# EAGLE schematic LoRaMicrobit1.0 (EAGLE 7.6.0)
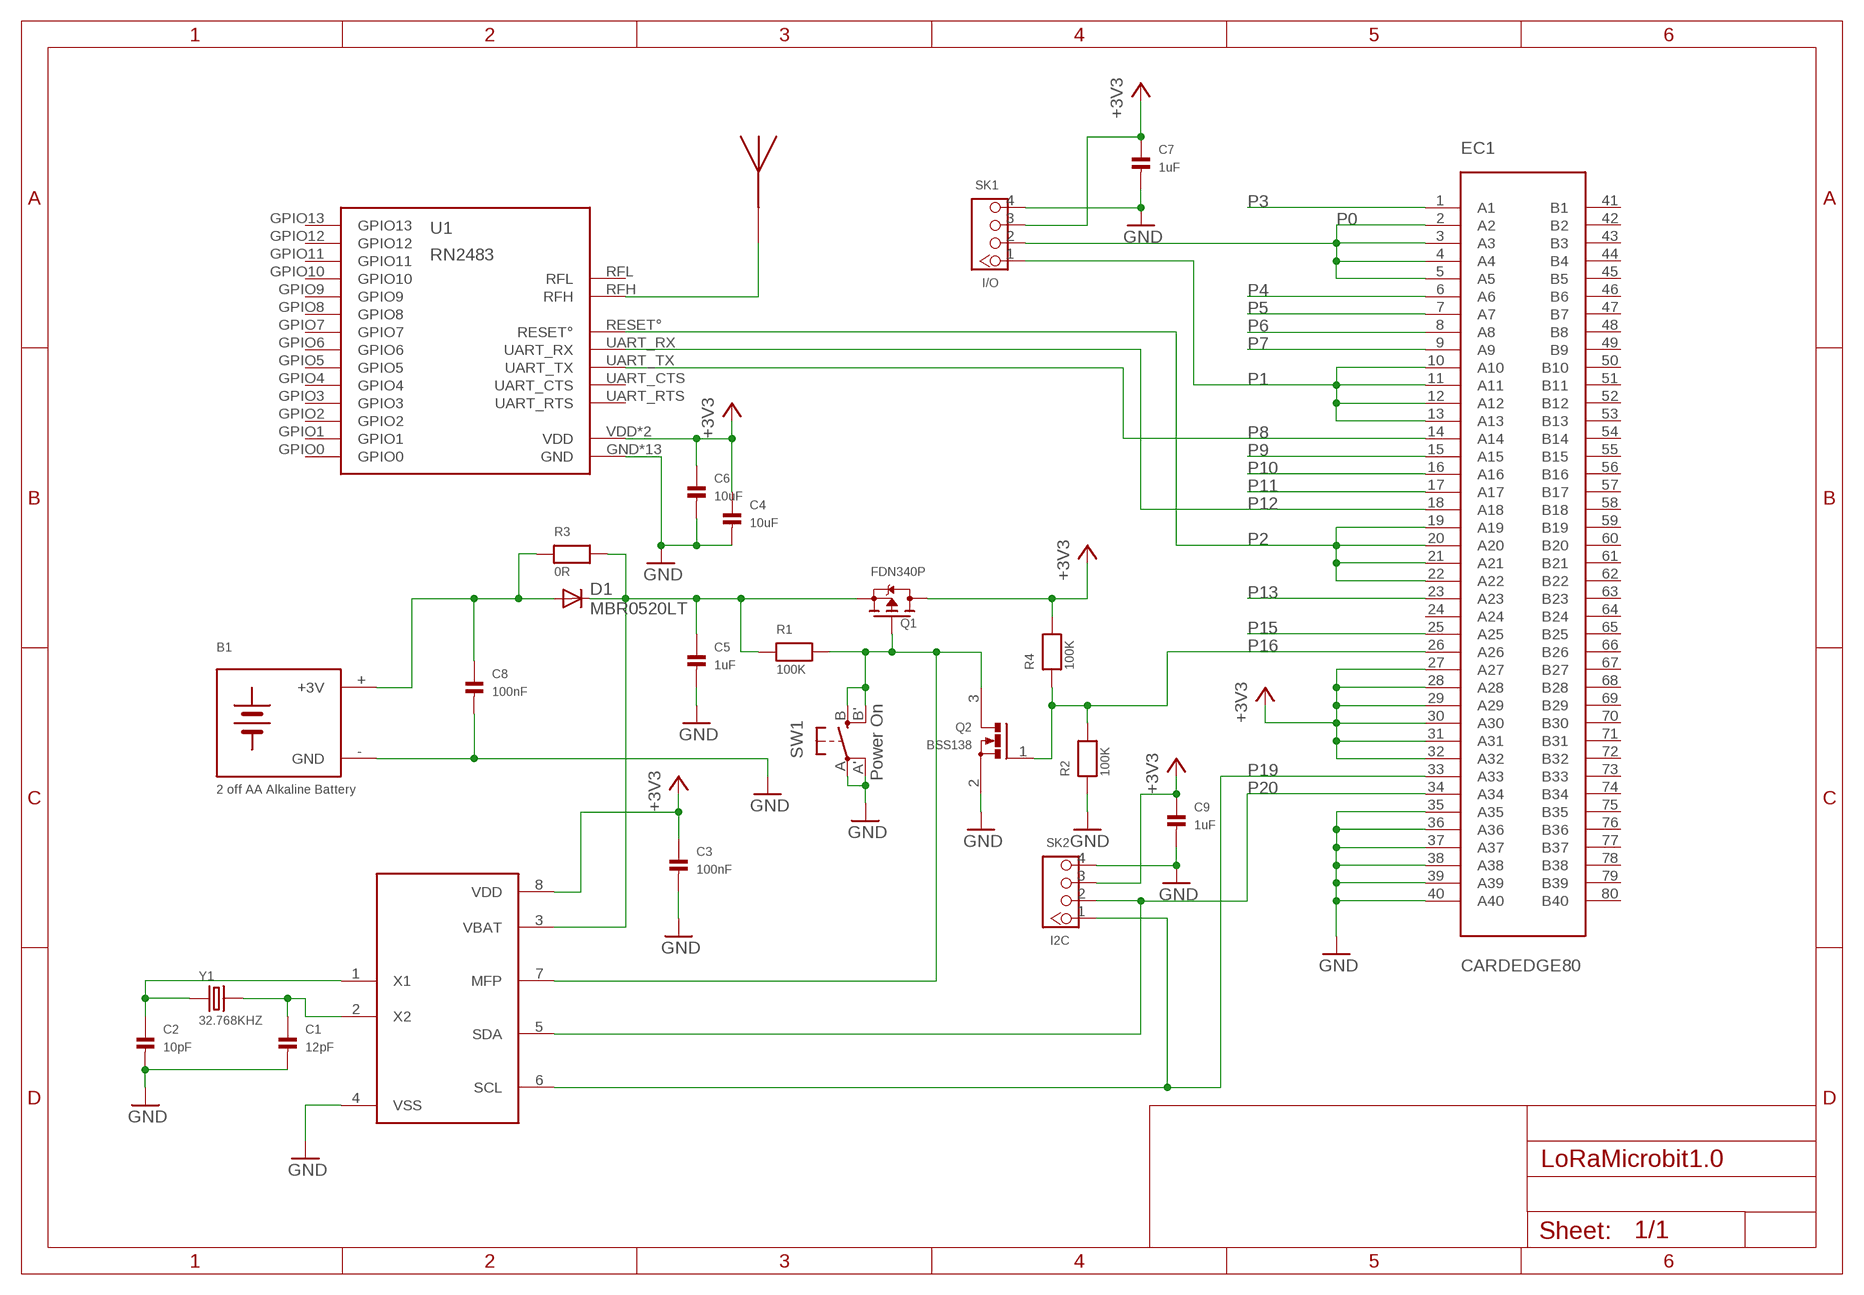
[diagram p0: schematic, sheet 1]

## Parts
B1  2 off AA Alkaline Battery  2AABATTERY  [2AABATTERY]
C1  12pF  CAP_CERAMIC0603  [0603]
C2  10pF  CAP_CERAMIC0603  [0603]
C3  100nF  CAP_CERAMIC0603  [0603]
C4  10uF  CAP_CERAMIC0603  [0603]
C5  1uF  CAP_CERAMIC0603  [0603]
C6  10uF  CAP_CERAMIC0603  [0603]
C7  1uF  CAP_CERAMIC0603  [0603]
C8  100nF  CAP_CERAMIC0603  [0603]
C9  1uF  CAP_CERAMIC0603  [0603]
D1  MBR0520LT  [SOD123]
EC1  CARDEDGE80  [CARDEDGE80]
Q1  FDN340P  MOSFET-P  [SOT23-R]
Q2  BSS138  MOSFET-NREFLOW  [SOT23-R]
R1  100K  RESISTOR0603  [0603]
R2  100K  RESISTOR0603  [0603]
R3  0R  RESISTOR0603  [0603]
R4  100K  RESISTOR0603  [0603]
SK1  I/O  GROVE-CONNECTOR-DIP-90D(4P-2.0)  [HW4-2.0-90D]
SK2  I2C  GROVE-CONNECTOR-DIP-90D(4P-2.0)  [HW4-2.0-90D]
SW1  Power On  SPST_TACT-EVQQ2  [EVQ-Q2]
U1  RN2483  [RN2483]
U2  MCP7940N  [SOIC8-N_MC]
U$2  0868AT43A0020  [0868AT043A0020]
Y1  32.768KHZ  SMD-CRYSTAL-ABS07-32.768KHZ-7PF-20PPM-70K(2P-3.2X1.5MM)  [X2-SMD-3.2X1.5X0.55MM]

## Nets
+3V3: C3.1 C4.1 C6.1 C7.1 C9.1 EC1.27(A27) EC1.28(A28) EC1.29(A29) EC1.30(A30) EC1.31(A31) EC1.32(A32) Q1.3(D) R4.2 SK1.3 SK2.3 U1.VDD U1.VDD2(VDD) U2.8(VDD)
GND: B1.-(GND) C1.2 C2.2 C3.2 C4.2 C5.2 C6.2 C7.2 C8.2 C9.2 EC1.35(A35) EC1.36(A36) EC1.37(A37) EC1.38(A38) EC1.39(A39) EC1.40(A40) Q2.2(S) R2.1 SK1.4 SK2.4 SW1.A'(P1) SW1.A(P) U1.GND U1.GND1(GND) U1.GND2(GND) U1.GND3(GND) U1.GND4(GND) U1.GND5(GND) U1.GND6(GND) U1.GND7(GND) U1.GND8(GND) U1.GND9(GND) U1.GND10(GND) U1.GND11(GND) U1.GND12(GND) U2.4(VSS)
N$1: U1.RFH U$2.P$1
N$2: C2.1 U2.1(X1) Y1.1
N$3: C1.1 U2.2(X2) Y1.2
N$5: B1.+(+3V) C8.1 D1.A R3.1
N$8: C5.1 D1.C Q1.2(S) R1.1 R3.2 U2.3(VBAT)
N$9: Q1.1(G) Q2.3(D) R1.2 SW1.B'(S1) SW1.B(S) U2.7(MFP)
P0: EC1.2(A2) EC1.3(A3) EC1.4(A4) EC1.5(A5) SK1.2
P1: EC1.10(A10) EC1.11(A11) EC1.12(A12) EC1.13(A13) SK1.1
P2: EC1.19(A19) EC1.20(A20) EC1.21(A21) EC1.22(A22) U1.RESET°
P3: EC1.1(A1)
P4: EC1.6(A6)
P5: EC1.7(A7)
P6: EC1.8(A8)
P7: EC1.9(A9)
P8: EC1.14(A14) U1.UART_TX
P9: EC1.15(A15)
P10: EC1.16(A16)
P11: EC1.17(A17)
P12: EC1.18(A18) U1.UART_RX
P13: EC1.23(A23)
P15: EC1.25(A25)
P16: EC1.26(A26) Q2.1(G) R2.2 R4.1
P19: EC1.33(A33) SK2.1 U2.6(SCL)
P20: EC1.34(A34) SK2.2 U2.5(SDA)
Unconnected: EC1.24(A24) EC1.41(B1) EC1.42(B2) EC1.43(B3) EC1.44(B4) EC1.45(B5) EC1.46(B6) EC1.47(B7) EC1.48(B8) EC1.49(B9) EC1.50(B10) EC1.51(B11) EC1.52(B12) EC1.53(B13) EC1.54(B14) EC1.55(B15) EC1.56(B16) EC1.57(B17) EC1.58(B18) EC1.59(B19) EC1.60(B20) EC1.61(B21) EC1.62(B22) EC1.63(B23) EC1.64(B24) EC1.65(B25) EC1.66(B26) EC1.67(B27) EC1.68(B28) EC1.69(B29) EC1.70(B30) EC1.71(B31) EC1.72(B32) EC1.73(B33) EC1.74(B34) EC1.75(B35) EC1.76(B36) EC1.77(B37) EC1.78(B38) EC1.79(B39) EC1.80(B40) U1.GPIO0 U1.GPIO1 U1.GPIO2 U1.GPIO3 U1.GPIO4 U1.GPIO5 U1.GPIO6 U1.GPIO7 U1.GPIO8 U1.GPIO9 U1.GPIO10 U1.GPIO11 U1.GPIO12 U1.GPIO13 U1.RFL U1.UART_CTS U1.UART_RTS

## Library data of the parts
B1 = Microbit:2AABATTERY
C1-C9 = microbuilder:CAP_CERAMIC: Ceramic Capacitors 0402 - 0402 Surface Mount Capacitors 0.1uF 10V 10% [Digikey: 490-1318-2-ND] 0603 - 0603 Surface Mount Capacitors 16 pF 50V 5% [Digikey: 445-5051-2-ND] 22 pF 50V [Digikey: PCC220ACVTR-ND] 33 pF 50V 5% [Digikey: 490-1415-1-ND] 56pF 50V 5% [Digikey: 490-1421-1-ND] 220pF 50V 5% [Digikey: 445-1285-1-ND] 680 pF 50V 2200 pF 50V 5% C0G [Digikey: 445-1297-1-ND] 5600 pF 100V 5% X7R [Digikey: 478-3711-1-ND] 0.1 µF 25V 10% [Digikey: PCC2277TR-ND] 0.22 µF 16V 10% X7R [Digikey: 445-1318-1-ND] 1.0 µF 25V 10% [Digikey: 445-5146-2-ND] 0603 - RF Specific 3pF 250V +/-0.1pF RF [Digikey: 712-1347-1-ND] 18 pF 250V 5% [Digikey: 478-3505-1-ND or 712-1322-1-ND] 56 pF 250V 5% C0G RF [Digikey: 490-4867-1-ND] 68 pF 250V RF [Digikey: 490-4868-1-ND] 0805 - 0805 Surface Mount Capacitors 220 pF 250V 2% RF Ceramic Capacitor [Digikey: 712-1398-1-ND] 1000 pF 50V 2% NP0 Ceramic Capacitor [Digikey: 478-3760-1-ND] 0.1 µF 25V 10% Ceramic Capacitor [Digikey: PCC1828TR-ND] 1.0 µF 16V 10% Ceramic Capacitor[Digikey: 490-1691-2-ND] 10.0 µF 10V 10% Ceramic Capacitor[Digikey: 709-1228-1-ND] 1206 - 1206 Surface Mount Capacitors
D1 = diode:MBR0520LT: SCHOTTKY BARRIER RECTIFIER Source: http://onsemi.com .. MBR0520LT1-D.pdf
EC1 = Microbit:CARDEDGE80: BBC Micro:Bit 80 Pos .05" Connector
Q1 = microbuilder:MOSFET-P: P-Channel Mosfet SOT-23 NTR0202PL 20V 400mA - Digikey: NTR0202PLT1GOSTR-ND NTR4101PT1G 20V 1.8A - Digikey: NTR4101PT1GOSCT-ND
Q2 = microbuilder:MOSFET-N: N-Channel Mosfet Digikey: 2N7002ET1GOSTR-ND
R1-R4 = microbuilder:RESISTOR: Resistors 0402 - 0402 Surface Mount Package 10.0K 1% 1/16W [Digikey: 311-10.0KLRTR-ND] 0603 - 0603 Surface Mount Package 0 Ohm 1/10 Watt 1% Resistor 15 Ohm 1/10 Watt 1% Resistor 33 Ohm 1/10 Watt 1% Resistor 49.9 Ohm 1/10 Watt 1% Resistor 100 Ohm 1/10 Watt 1% Resistor 150 Ohm 1/10 Watt 1% Resistor 240 Ohm 1/10 Watt 1% Resistor 390 Ohm 1/10 Watt 1% Resistor 560 Ohm 1/10 Watt 1% Resistor 750 Ohm 1/10 Watt 1% Resistor 1.0K Ohm 1/10 Watt 1% Resistor 1.5K Ohm 1/10 Watt 1% Resistor 2.0K Ohm 1/10 Watt 1% Resistor 4.7K Ohm 1/10 Watt 1% Resistor 10.0K Ohm 1/10 Watt 1% Resistor 20.0K Ohm 1/10 Watt 1% Resistor 33.0K Ohm 1/10 Watt 1% Resistor 100.0K Ohm 1/10 Watt 1% Resistor 0805 - 0805 Surface Mount Package 0 Ohm 1/8 Watt 1% Resistor 33 Ohm 1/8 Watt 1% Resistor 100 Ohm 1/8 Watt 1% Resistor 150 Ohm 1/8 Watt 1% Resistor 200 Ohm 1/8 Watt 1% Resistor 240 Ohm 1/8 Watt 1% Resistor 330 Ohm 1/8 Watt 1% Resistor 390 Ohm 1/8 Watt 1% Resistor 470 Ohm 1/8 Watt 1% Resistor 1.0K Ohm 1/8 Watt 1% Resistor 1.5K Ohm 1/8 Watt 1% Resistor 2.0K Ohm 1/8 Watt 1% Resistor 4.7K Ohm 1/8 Watt 1% Resistor 5.1K Ohm 1/8 Watt 1% Resistor 5.6K Ohm 1/8 Watt 1% Resistor 10.0K Ohm 1/8 Watt 1% Resistor 22.0K Ohm 1/8 Watt 1% Resistor 33.0K Ohm 1/8 Watt 1% Resistor 100K Ohm 1/8 Watt 1% Resistor 1206 - 1206 Surface Mount Package
SK1 SK2 = Seeed-OPL-Connector:GROVE-CONNECTOR-DIP-90D(4P-2.0): 320110034; VALUE: 4P-2.0-90D
SW1 = adafruit:SPST_TACT: SMT 6mm switch, EVQQ2 series http://www.ladyada.net/library/eagle
U1 = tobias:RN2483: RN2483 Microchip Low-Power Lora Transceiver Module NOT TESTED There are testpads on the bottom of the device. The mask is supposed to cover that, but I have not tested it in practice yet. Info: http://www.microchip.com/wwwproducts/Devices.aspx?product=RN2483 Datasheet: http://ww1.microchip.com/downloads/en/DeviceDoc/50002346B.pdf Adapted from: https://github.com/Octanis1/Octanis1-Electronics/blob/ae493cac28c100e20856abe563dfe8824e9cc4bd/lib/Octanis1.lbr
U2 = Microbit:MCP7940N
U$2 = Microbit:0868AT43A0020
Y1 = Seeed-Crystal Oscillator-2016:SMD-CRYSTAL-ABS07-32.768KHZ-7PF-20PPM-70K(2P-3.2X1.5MM): 306010055; MPN: FC-135